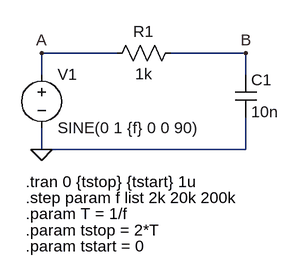
[diagram p0: schematic rc-circuit.asc]
rc-circuit.asc, the LTspice schematic file:
Version 4
SHEET 1 880 680
WIRE 160 112 48 112
WIRE 352 112 240 112
WIRE 48 144 48 112
WIRE 352 144 352 112
WIRE 48 256 48 224
WIRE 352 256 352 208
WIRE 352 256 48 256
FLAG 48 256 0
FLAG 48 112 A
FLAG 352 112 B
SYMBOL voltage 48 128 R0
WINDOW 123 0 0 Left 0
WINDOW 39 0 0 Left 0
SYMATTR InstName V1
SYMATTR Value SINE(0 1 {f} 0 0 90)
SYMBOL res 256 96 R90
WINDOW 0 0 56 VBottom 2
WINDOW 3 32 56 VTop 2
SYMATTR InstName R1
SYMATTR Value 1k
SYMBOL cap 336 144 R0
SYMATTR InstName C1
SYMATTR Value 10n
TEXT 24 304 Left 2 !.tran 0 {tstop} {tstart} 1u
TEXT 24 328 Left 2 !.step param f list 2k 20k 200k
TEXT 24 352 Left 2 !.param T = 1/f
TEXT 24 376 Left 2 !.param tstop = 2*T
TEXT 24 400 Left 2 !.param tstart = 0

The netlist it stands for:
* rc-circuit.asc
V1 A 0 SINE(0 1 {f} 0 0 90)
R1 B A 1k
C1 B 0 10n
.tran 0 {tstop} {tstart} 1u
.step param f list 2k 20k 200k
.param T = 1/f
.param tstop = 2*T
.param tstart = 0
.backanno
.end